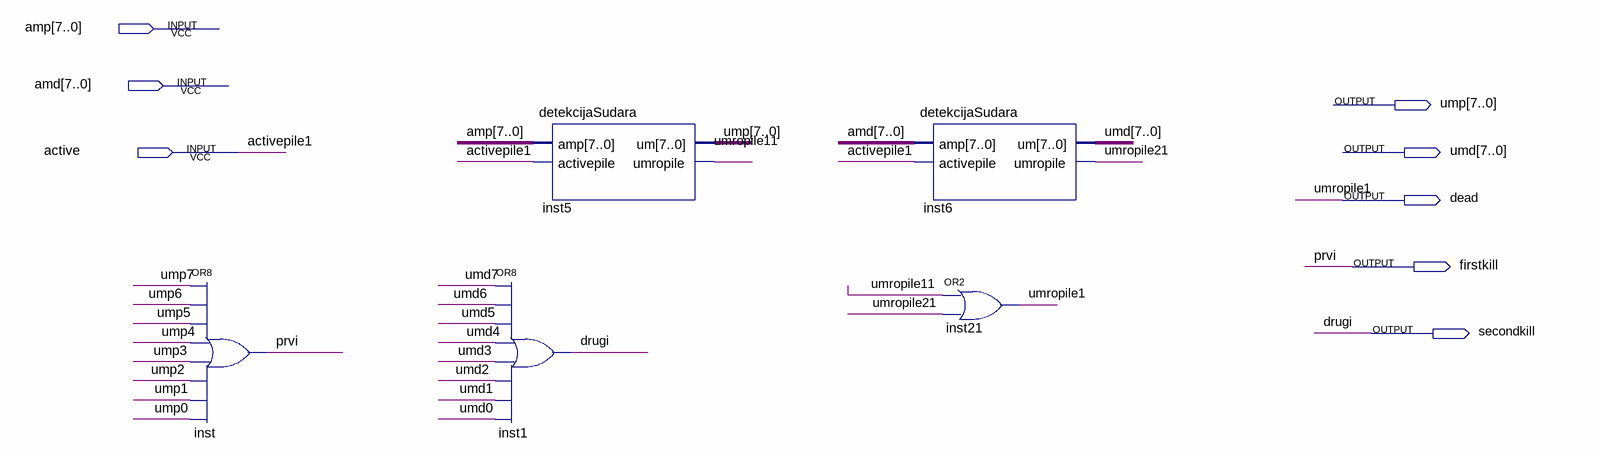
[diagram p0: schematic sheet]
// Quartus schematic deadchicken.bdf as structural Verilog: 5 symbols, 8 pins
module deadchicken (
  input  [7:0] amp,
  input  [7:0] amd,
  input  active,
  output [7:0] ump,
  output [7:0] umd,
  output dead,
  output firstkill,
  output secondkill
);

  wire umropile11, umropile21;

  or inst (firstkill, ump[7], ump[6], ump[5], ump[4], ump[3], ump[2], ump[1], ump[0]);
  detekcijaSudara inst5 (.amp(amp), .activepile(active), .um(ump), .umropile(umropile11));
  or inst1 (secondkill, umd[7], umd[6], umd[5], umd[4], umd[3], umd[2], umd[1], umd[0]);
  detekcijaSudara inst6 (.amp(amd), .activepile(active), .um(umd), .umropile(umropile21));
  or inst21 (dead, umropile11, umropile21);

  // Other names for the same wires on the sheet: activepile1 = active; drugi = secondkill; prvi = firstkill;
  //   umropile1 = dead
endmodule
